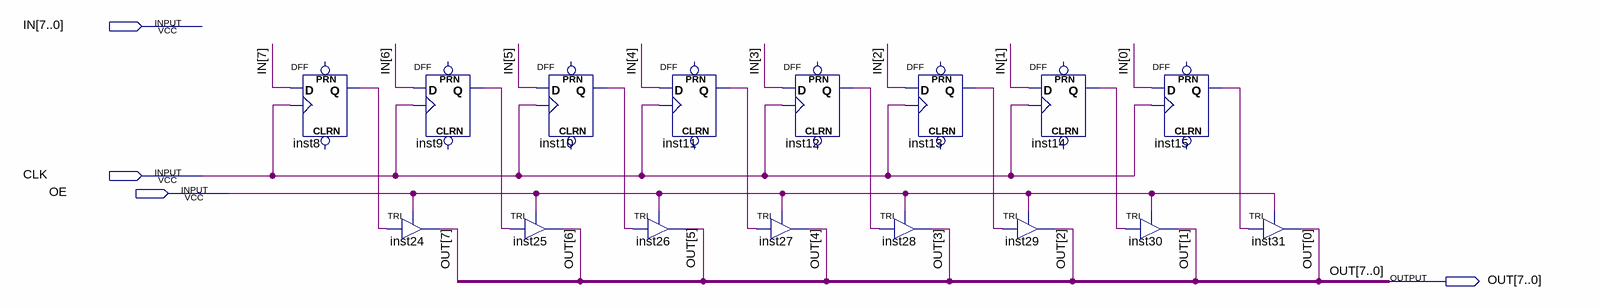
[diagram p0: schematic sheet]
// Quartus schematic ReadOut.bdf as structural Verilog: 16 symbols, 4 pins
module ReadOut (
  input  [7:0] IN,
  input  CLK,
  input  OE,
  output [7:0] OUT
);

  wire inst8_q, inst9_q, inst10_q, inst11_q, inst12_q, inst13_q, inst14_q, inst15_q;

  DFF inst8 (.CLK(CLK), .D(IN[7]), .Q(inst8_q));  // open: CLRN, PRN
  DFF inst9 (.CLK(CLK), .D(IN[6]), .Q(inst9_q));  // open: CLRN, PRN
  TRI inst24 (.IN(inst8_q), .OE(OE), .OUT(OUT[7]));
  DFF inst10 (.CLK(CLK), .D(IN[5]), .Q(inst10_q));  // open: CLRN, PRN
  TRI inst25 (.IN(inst9_q), .OE(OE), .OUT(OUT[6]));
  TRI inst26 (.IN(inst10_q), .OE(OE), .OUT(OUT[5]));
  DFF inst11 (.CLK(CLK), .D(IN[4]), .Q(inst11_q));  // open: CLRN, PRN
  TRI inst27 (.IN(inst11_q), .OE(OE), .OUT(OUT[4]));
  DFF inst12 (.CLK(CLK), .D(IN[3]), .Q(inst12_q));  // open: CLRN, PRN
  DFF inst13 (.CLK(CLK), .D(IN[2]), .Q(inst13_q));  // open: CLRN, PRN
  TRI inst28 (.IN(inst12_q), .OE(OE), .OUT(OUT[3]));
  DFF inst14 (.CLK(CLK), .D(IN[1]), .Q(inst14_q));  // open: CLRN, PRN
  TRI inst29 (.IN(inst13_q), .OE(OE), .OUT(OUT[2]));
  TRI inst30 (.IN(inst14_q), .OE(OE), .OUT(OUT[1]));
  DFF inst15 (.CLK(CLK), .D(IN[0]), .Q(inst15_q));  // open: CLRN, PRN
  TRI inst31 (.IN(inst15_q), .OE(OE), .OUT(OUT[0]));
endmodule
